# EAGLE design ptn_2013 (EAGLE 5.10)
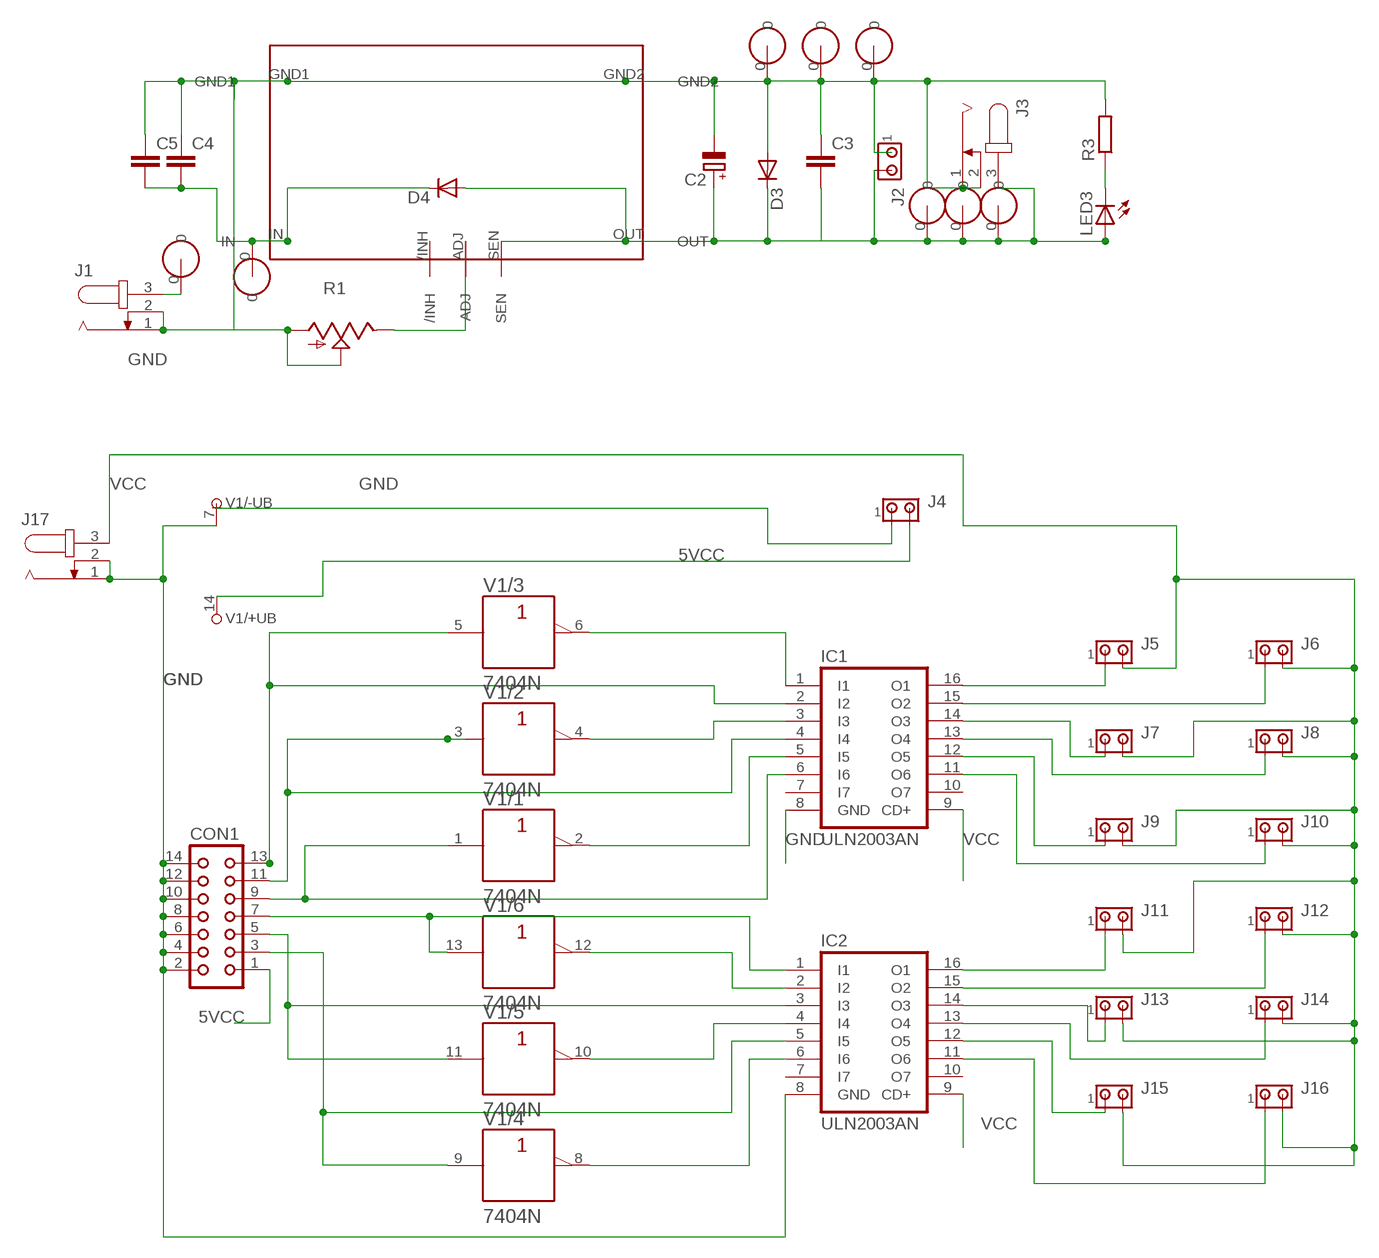
[diagram p0: schematic, sheet 1]

## Parts
C2  CPOL-EUE3.5-8  [E3,5-8]
C3  C-EUC1206K  [C1206K]
C4  C-EUC1206K  [C1206K]
C5  C-EUC1206K  [C1206K]
CON1  CON14  [CON14]
D3  DIODE-SMB  [SMB]
D4  DIODE-SMB  [SMB]
IC1  ULN2003AN  [DIL16]
IC2  ULN2003AN  [DIL16]
J1  JACK-PLUG1  [SPC4078]
J2  MTA02-100  [10X02MTA]
J3  JACK-PLUG1  [SPC4078]
J4  MTA02-100  [10X02MTA]
J5  MTA02-100  [10X02MTA]
J6  MTA02-100  [10X02MTA]
J7  MTA02-100  [10X02MTA]
J8  MTA02-100  [10X02MTA]
J9  MTA02-100  [10X02MTA]
J10  MTA02-100  [10X02MTA]
J11  MTA02-100  [10X02MTA]
J12  MTA02-100  [10X02MTA]
J13  MTA02-100  [10X02MTA]
J14  MTA02-100  [10X02MTA]
J15  MTA02-100  [10X02MTA]
J16  MTA02-100  [10X02MTA]
J17  JACK-PLUG1  [SPC4078]
LED3  LED3MM  [LED3MM]
R1  TRIM_US-B64Y  [B64Y]
R3  R-EU_R0603  [R0603]
U$1  PTNPTN2  [PTN]
U$2  PAD0  [SWITCHPAD]
U$3  PADSWITCHPAD1  [SWITCHPAD]
U$4  PADSWITCHPAD1  [SWITCHPAD]
U$5  PADSWITCHPAD1  [SWITCHPAD]
U$6  PADSWITCHPAD1  [SWITCHPAD]
U$7  PADSWITCHPAD1  [SWITCHPAD]
U$8  PADSWITCHPAD1  [SWITCHPAD]
U$9  PADSWITCHPAD1  [SWITCHPAD]
V1  7404N  [DIL14]

## Nets
5VCC: CON1.1 J4.2 V1.14(/+UB:+UB)
GND: C2.- C3.1 C4.1 C5.1 CON1.2 CON1.4 CON1.6 CON1.8 CON1.10 CON1.12 CON1.14 D3.A IC1.8(GND) IC2.8(GND) J1.1 J1.2 J2.1 J3.1 J3.2 J4.1 J17.1 J17.2 R1.A R1.S R3.2 U$1.GND1 U$1.GND2 U$4.0 U$6.0 U$8.0 V1.7(/-UB:-UB)
N$2: C4.2 C5.2 D4.C U$1.IN U$2.0
N$3: CON1.13 IC1.2(I2) V1.5(/3:A)
N$4: LED3.K(C) R3.1
N$5: R1.E U$1.ADJ
N$6: CON1.11 IC1.4(I4) V1.3(/2:A)
N$7: J1.3 U$3.0
N$8: CON1.9 IC1.6(I6) V1.1(/1:A)
N$9: C2.+ C3.2 D3.C D4.A J2.2 J3.3 LED3.A U$1.OUT U$1.SEN U$5.0 U$7.0 U$9.0
N$10: CON1.7 IC2.1(I1) V1.13(/6:A)
N$11: CON1.5 IC2.3(I3) V1.11(/5:A)
N$12: CON1.3 IC2.5(I5) V1.9(/4:A)
N$13: IC1.1(I1) V1.6(/3:Y)
N$14: IC2.2(I2) V1.12(/6:Y)
N$15: IC2.4(I4) V1.10(/5:Y)
N$16: IC2.6(I6) V1.8(/4:Y)
N$17: IC1.16(O1) J5.1
N$18: IC1.15(O2) J6.1
N$19: IC1.14(O3) J7.1
N$20: IC1.13(O4) J8.1
N$21: IC1.12(O5) J9.1
N$22: IC1.11(O6) J10.1
N$23: IC2.16(O1) J11.1
N$24: IC2.15(O2) J12.1
N$25: IC2.14(O3) J13.1
N$26: IC2.13(O4) J14.1
N$27: IC2.12(O5) J15.1
N$28: IC2.11(O6) J16.1
N$29: IC1.3(I3) V1.4(/2:Y)
N$30: IC1.5(I5) V1.2(/1:Y)
VCC: IC1.9(CD+) IC2.9(CD+) J5.2 J6.2 J7.2 J8.2 J9.2 J10.2 J11.2 J12.2 J13.2 J14.2 J15.2 J16.2 J17.3
Unconnected: IC1.7(I7) IC1.10(O7) IC2.7(I7) IC2.10(O7) U$1./INH

## Library data of the parts
C2 = rcl:CPOL-EU: POLARIZED CAPACITOR, European symbol
C3-C5 = rcl:C-EU: CAPACITOR, European symbol
CON1 = con-harting:CON14: CONNECTOR
D3 D4 = diode:DIODE-: DIODE
IC1 IC2 = uln-udn:ULN2003A: DRIVER ARRAY
J1 J3 J17 = con-jack:JACK-PLUG: DC POWER JACK Power Jack, DC, Right Angle, Through Hole, Rated 5A at 16VDC, PC Terminals Distributor: Farnell (www.Farnell.de) Drawing: 84N1161.pdf / 84N1162.pdf Manufacturer: SPC Technology (www.spctechnology.com) Type: SPC4077 / SPC 4078
J2 J4-J16 = con-amp:MTA02-100: AMP connector
LED3 = led:LED: LED OSRAM: - CHIPLED LG R971, LG N971, LY N971, LG Q971, LY Q971, LO R971, LY R971 LH N974, LH R974 LS Q976, LO Q976, LY Q976 LO Q996 - Hyper CHIPLED LW Q18S LB Q993, LB Q99A, LB R99A - SideLED LS A670, LO A670, LY A670, LG A670, LP A670 LB A673, LV A673, LT A673, LW A673 LH A674 LY A675 LS A676, LA A676, LO A676, LY A676, LW A676 LS A679, LY A679, LG A679 - Hyper Micro SIDELED® LS Y876, LA Y876, LO Y876, LY Y876 LT Y87S - SmartLED LW L88C, LW L88S LB L89C, LB L89S, LG L890 LS L89K, LO L89K, LY L89K LS L896, LA L896, LO L896, LY L896 - TOPLED LS T670, LO T670, LY T670, LG T670, LP T670 LSG T670, LSP T670, LSY T670, LOP T670, LYG T670 LG T671, LOG T671, LSG T671 LB T673, LV T673, LT T673, LW T673 LH T674 LS T676, LA T676, LO T676, LY T676, LB T676, LH T676, LSB T676, LW T676 LB T67C, LV T67C, LT T67C, LS T67K, LO T67K, LY T67K, LW E67C LS E67B, LA E67B, LO E67B, LY E67B, LB E67C, LV E67C, LT E67C LW T67C LS T679, LY T679, LG T679 LS T770, LO T770, LY T770, LG T770, LP T770 LB T773, LV T773, LT T773, LW T773 LH T774 LS E675, LA E675, LY E675, LS T675 LS T776, LA T776, LO T776, LY T776, LB T776 LHGB T686 LT T68C, LB T68C - Hyper Mini TOPLED® LB M676 - Mini TOPLED Santana® LG M470 LS M47K, LO M47K, LY M47K Source: http://www.osram.convergy.de LUXEON: - LUMILED® LXK2-PW12-R00, LXK2-PW12-S00, LXK2-PW14-U00, LXK2-PW14-V00 LXK2-PM12-R00, LXK2-PM12-S00, LXK2-PM14-U00 LXK2-PE12-Q00, LXK2-PE12-R00, LXK2-PE12-S00, LXK2-PE14-T00, LXK2-PE14-U00 LXK2-PB12-K00, LXK2-PB12-L00, LXK2-PB12-M00, LXK2-PB14-N00, LXK2-PB14-P00, LXK2-PB14-Q00 LXK2-PR12-L00, LXK2-PR12-M00, LXK2-PR14-Q00, LXK2-PR14-R00 LXK2-PD12-Q00, LXK2-PD12-R00, LXK2-PD12-S00 LXK2-PH12-R00, LXK2-PH12-S00 LXK2-PL12-P00, LXK2-PL12-Q00, LXK2-PL12-R00 Source: www.luxeon.com KINGBRIGHT: KA-3528ASYC Source: www.kingbright.com
R1 = pot:TRIM_US-: POTENTIOMETER
R3 = rcl:R-EU_: RESISTOR, European symbol
U$1 = ptn78020_2:PTN
U$2-U$9 = switchpad:PAD
V1 = 74ttl-din:74*04: Hex INVERTER

## Board
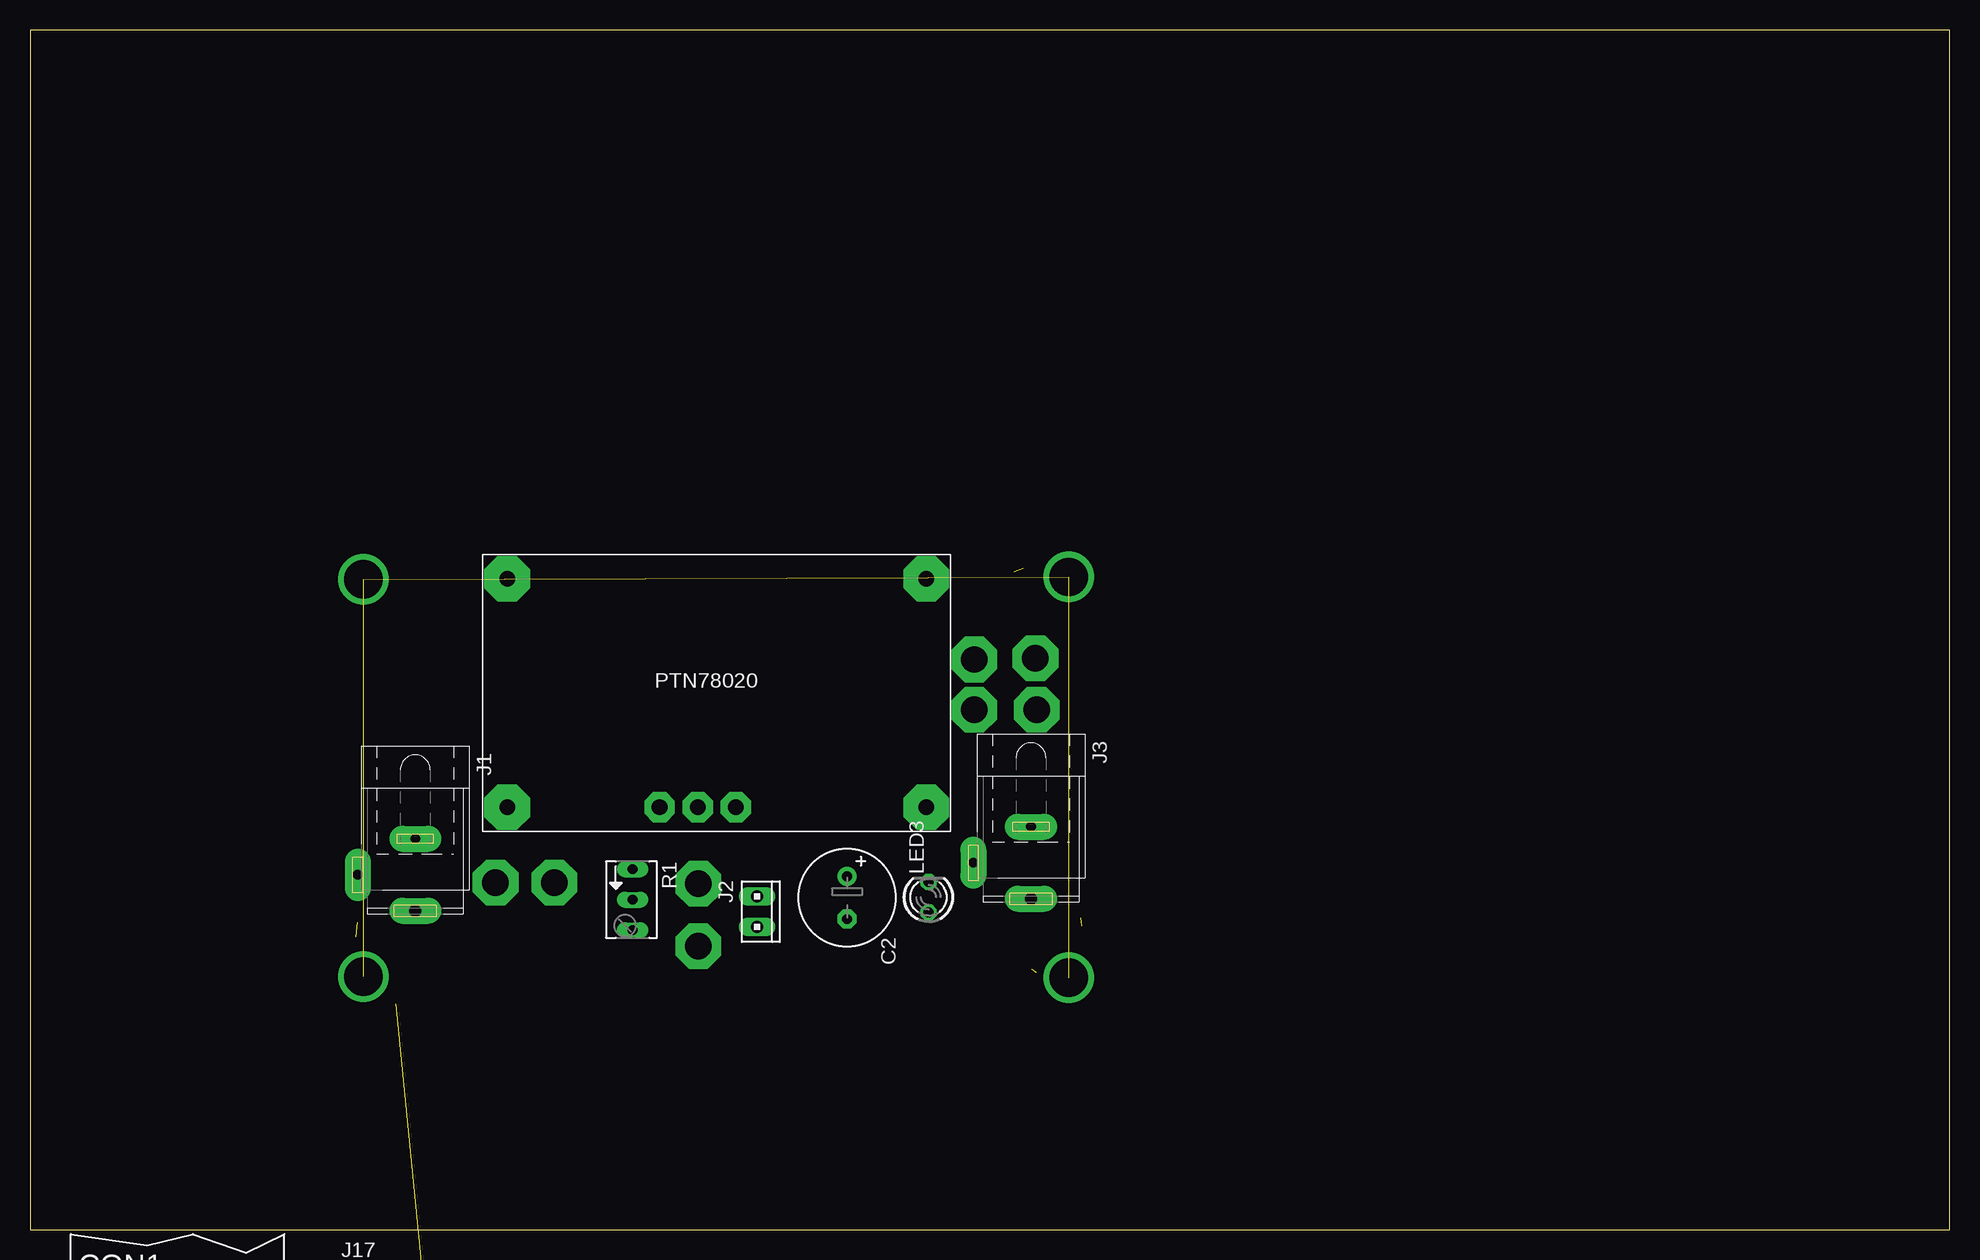
[diagram p1: board, top side]
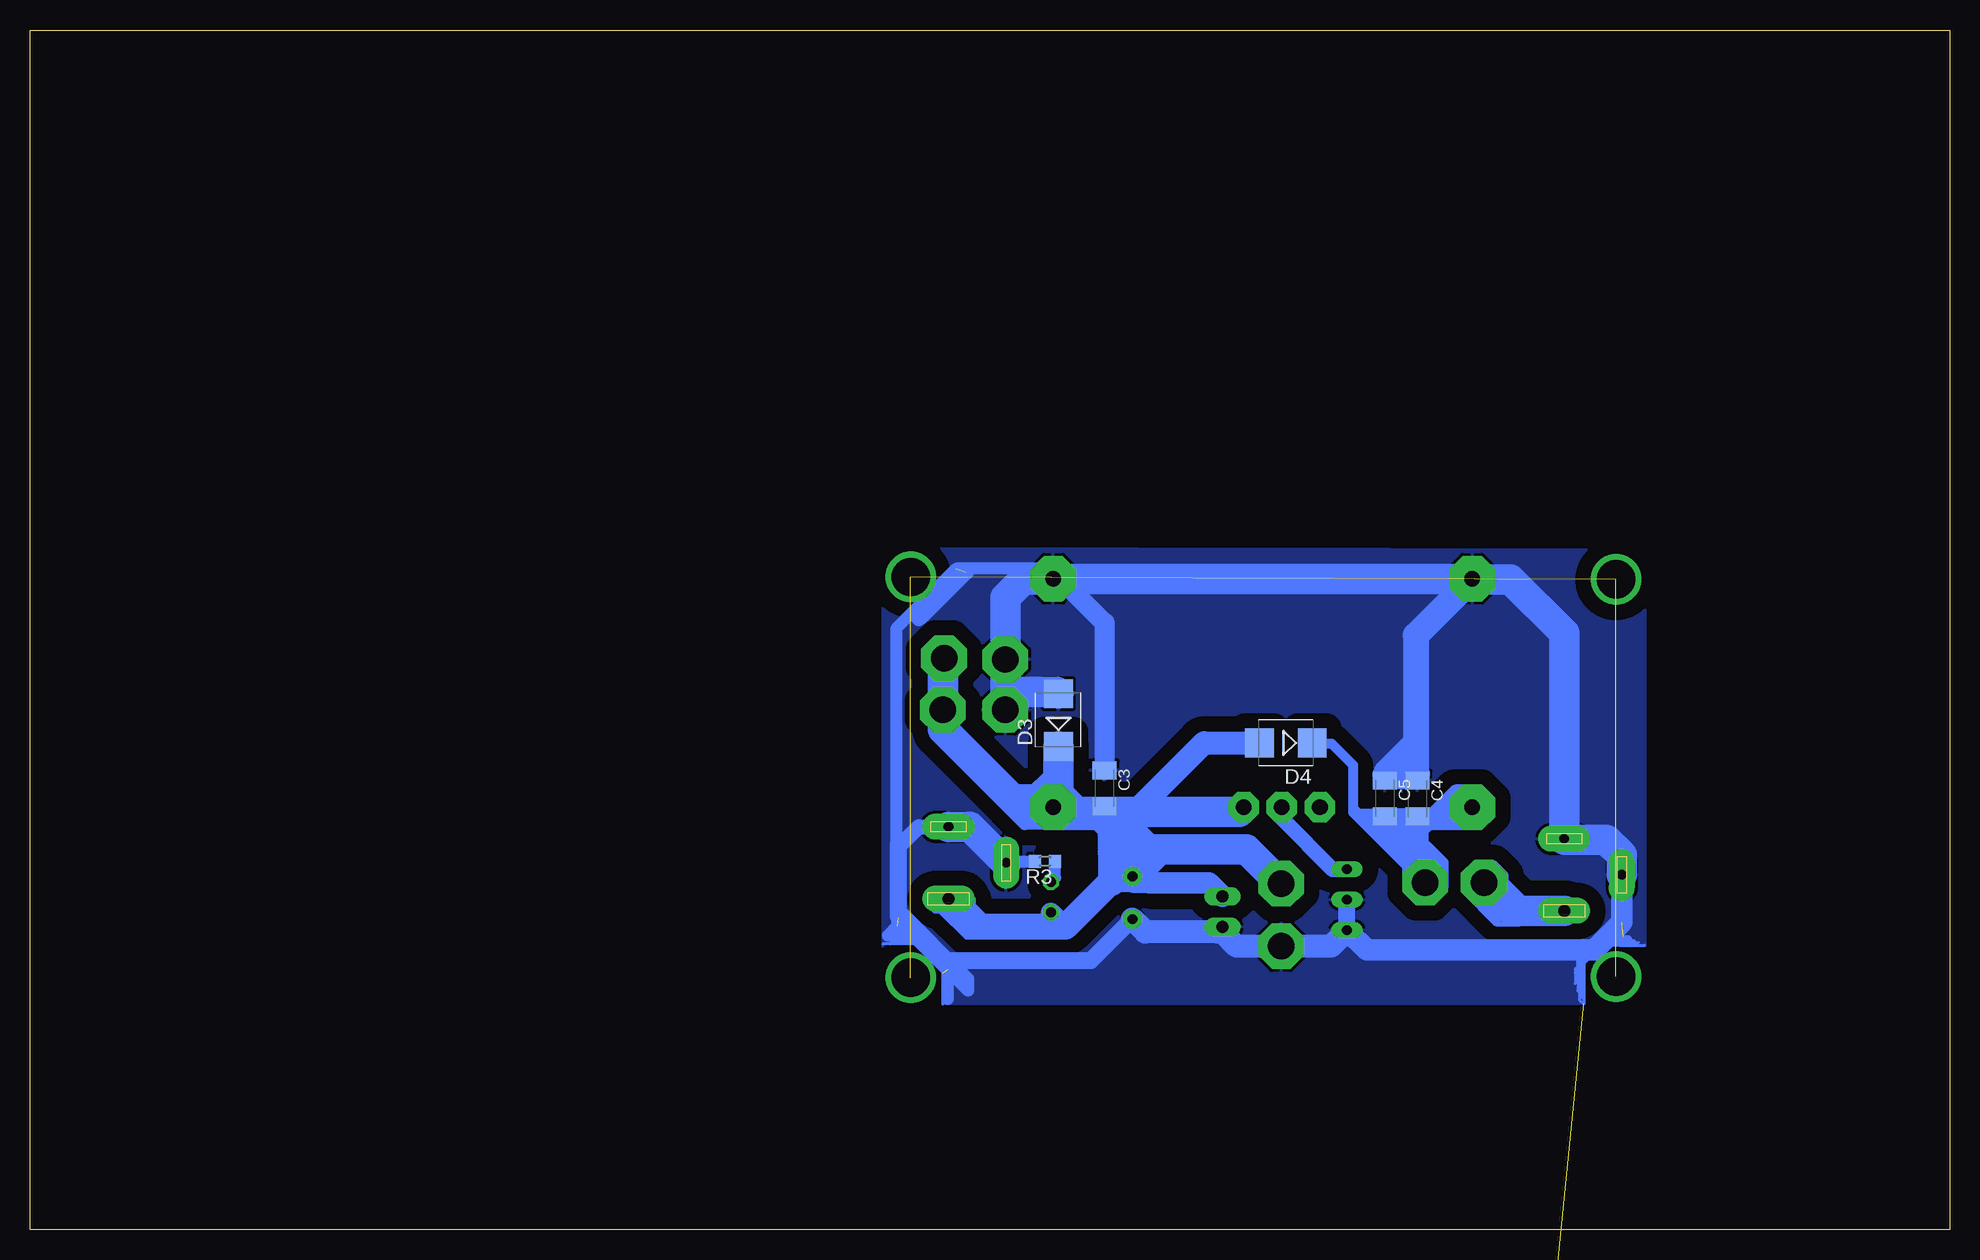
[diagram p2: board, bottom side, seen from below]

Size 160 x 100 mm. Coordinates in mm from the lower left corner, seen from the top.
Outline: 0,0 160,0 160,100 0,100 0,0
Copper layers (1*16): Top 0.035mm / dielectric 1.5mm / Bottom 0.035mm
Design rules "default *": minimum track width 10mil, minimum drill 24mil, track to track 50mil, track to pad 50mil, pad to pad 50mil, via to via 50mil, smd to smd 8mil, copper to edge 40mil, drill to drill 8mil, minimum pad ring 10mil, minimum via ring 8mil, stop-mask expansion 4mil, vias tented up to drill 0mil, thermal gap 10mil

### Footprints (pad centres in the part's own frame; a part is rotated, then mirrored left to right if it is on the bottom)
E3,5-8 = drill 0.813 pad 1.6 round: + -1.778,0 | drill 0.813 pad 1.6 octagon: - 1.778,0
C1206K = smd 1.5 x 2: 1 -1.5,0; 2 1.5,0
CON14 = drill 0.914 round: 1 -7.62,-1.27 | drill 0.914 octagon: 2 -7.62,1.27; 3 -5.08,-1.27; 4 -5.08,1.27; 5 -2.54,-1.27; 6 -2.54,1.27; 7 0,-1.27; 8 0,1.27; 9 2.54,-1.27; 10 2.54,1.27; 11 5.08,-1.27; 12 5.08,1.27; 13 7.62,-1.27; 14 7.62,1.27
SMB = smd 2.4 x 2.4: A 2.2,0; C -2.2,0
DIL16 = drill 0.813 long: 1 -8.89,-3.81; 2 -6.35,-3.81; 3 -3.81,-3.81; 4 -1.27,-3.81; 5 1.27,-3.81; 6 3.81,-3.81; 7 6.35,-3.81; 8 8.89,-3.81; 9 8.89,3.81; 10 6.35,3.81; 11 3.81,3.81; 12 1.27,3.81; 13 -1.27,3.81; 14 -3.81,3.81; 15 -6.35,3.81; 16 -8.89,3.81
SPC4078 = drill 0.8 pad 2.184 long: 1 -3,0; 2 0,-4.8 | drill 1 pad 2.184 long: 3 3,0
10X02MTA = drill 1.016 long: 1 1.27,0; 2 -1.27,0
LED3MM = drill 0.813 octagon: A -1.27,0; K 1.27,0
B64Y = drill 0.813 long: A 2.54,0; E -2.54,0; S 0,0
R0603 = smd 1 x 1.1: 1 -0.85,0; 2 0.85,0
PTN = drill 1.3 pad 2.54 octagon: /INH 14.73,-21.08; ADJ 17.91,-21.08; SEN 21.09,-21.08 | drill 1.3 pad 3.81 octagon: GND1 2.03,-2.03; GND2 36.96,-2.03; IN 2.03,-21.08; OUT 36.96,-21.08
SWITCHPAD = drill 2.2 pad 3.81 octagon: 0 -0.093,-0.175
DIL14 = drill 0.813 long: 1 -7.62,-3.81; 2 -5.08,-3.81; 3 -2.54,-3.81; 4 0,-3.81; 5 2.54,-3.81; 6 5.08,-3.81; 7 7.62,-3.81; 8 7.62,3.81; 9 5.08,3.81; 10 2.54,3.81; 11 0,3.81; 12 -2.54,3.81; 13 -5.08,3.81; 14 -7.62,3.81

### Placement (x,y rotation side)
C2  68.11,27.66 270 top
C3  70.43,36.79 270 bottom
C4  44.34,35.93 270 bottom
C5  47.06,35.96 270 bottom
CON1  12.3,-9.9 0 top  (outside the outline)
D3  74.28,42.47 90 bottom
D4  55.33,40.57 180 bottom
IC1  12.3,-21.4 0 top  (outside the outline)
IC2  12.3,-34.5 0 top  (outside the outline)
J1  32.12,29.57 270 top
J2  60.6,26.5 270 top
J3  83.44,30.57 270 top
J4  3.3,-43.5 0 top  (outside the outline)
J5  9.9,-43.5 0 top  (outside the outline)
J6  16.5,-43.6 0 top  (outside the outline)
J7  23.1,-43.6 0 top  (outside the outline)
J8  29.7,-43.5 0 top  (outside the outline)
J9  36.3,-43.5 0 top  (outside the outline)
J10  3.3,-50.2 0 top  (outside the outline)
J11  9.9,-50.2 0 top  (outside the outline)
J12  16.5,-50.2 0 top  (outside the outline)
J13  23.1,-50.2 0 top  (outside the outline)
J14  29.7,-50.2 0 top  (outside the outline)
J15  36.3,-50.2 0 top  (outside the outline)
J16  3.3,-56.8 0 top  (outside the outline)
J17  36.1,-7.4 0 top  (outside the outline)
LED3  74.9,27.7 90 top
R1  50.23,27.49 270 top
R3  75.4,30.7 180 bottom
U$1  37.75,56.28 0 top
U$2  43.8,29.1 0 top
U$3  38.9,29.1 0 top
U$4  55.8,23.8 0 top
U$5  55.8,29 0 top
U$6  78.8,43.5 0 top
U$7  84,43.5 0 top
U$8  78.8,47.7 0 top
U$9  83.9,47.8 0 top
V1  34.5,-34.5 0 top  (outside the outline)

### Tracks (layer width: path | path; a pad name or v marks a point on that pad's centre or on a via)
5VCC  (2 unrouted)
GND  (17 unrouted)
  Bottom 0.254: 83.9,18.8 83.9,21.4 86.3,23.8 88.3,23.8 | 88.3,23.8 88.9,23.8 | 88.3,23.8 88.1,24 86.8,24 86.7,23.9 | 30.8,22.5 30.8,19.1 30.5,18.8 30.5,22.5 30.7,22.7 30.7,19.4 30.6,19.3 30.6,19.5 31,19.9 31,21.6 | 31,21.6 31,22.4 | 31.2,21.4 31,21.6 | 31.2,21.4 31.2,20.5 | 31.2,21.4 31.2,21.7 31.1,21.8 30.8,21.8 28.4,24.2 28.4,23.9 28.2,23.7 27.5,23.7 | 27.5,23.7 25.4,23.7 | 27.5,23.7 27.7,23.9 26.1,23.9 | 26.1,23.9 25.9,23.9 | 26.1,23.9 26.3,24.1 27.5,24.1 27.2,24.4 26.7,24.4 26.6,24.3 27.2,24.3 27.3,24.2
  Bottom 1.016: R3.2 78.1,30.7 78.23,30.57 J3.2 | 87.6,32.3 87.6,32.4 87.8,32.6 87.8,50.1 82.8,55.1 75.7,55.1 74.8,54.2 74.7,54.1 | 87.6,25 86.9,25 81.8,19.9 81.8,20.9 87.7,26.8 87.7,25.3 88.5,24.5 86.2,24.5 86.1,24.4 86.1,24.3 83.5,21.7 83.5,19.2
  Bottom 1.27: J3.1 85.93,33.57 87.6,31.9 | 81.9,54.8 82,54.8 85.9,50.9
  Bottom 1.422: C4.1 44.37,37.46 C5.1 44.54,37.46 44,38 44.5,38 | 44.5,38 47.1,38 47.3,38 47.4,37.9 44.6,37.9 44.5,38 | R1.A R1.S | 60.5,24.7 60.5,25.13 J2.1 60.6,25.2 61,24.8 | C2.- 71.59,22.4 84,22.4 87.6,26 87.6,31.9 87.6,32.3
  Bottom 1.676: C3.1 70.42,50.57 74.1,54.25
  Bottom 1.778: R1.A 48.57,23.3 29.6,23.3 27.32,25.58 J1.2
  Bottom 1.93: 47.1,38 47.1,38.1 44.8,40.4 | R1.A 51.56,23.62 U$4.0 59.42,23.62 60.5,24.7 | 61,24.8 67.02,24.8 C2.-
  Bottom 2.184: 44.5,38 44.5,49.53 U$1.GND1
  Bottom 2.54: J1.2 27.32,31.22 28.6,32.5 32.05,32.5 J1.1 32.12,49.72 36.6,54.2 39.73,54.2 U$1.GND1 74.1,54.25 U$1.GND2 74.76,54.2 74.8,54.2 77.2,54.2 78.71,52.69 U$8.0 U$6.0 77.23,44.8 74.41,44.8 D3.A | J3.2 81.64,33.57 J3.1
  pour Bottom: 25.4,18.8 88.9,18.8 88.9,56.8 25.4,56.7
N$1  (via drill 3.2)  (3 unrouted)
  other vias: 27.8,54.2 27.8,21.1 86.6,21 86.6,54.4
N$2
  Bottom 0.254: 47.9,33 49.5,34.6 49.3,34.6 | 49.3,34.6 48.3,33.6 48.3,33.8 48.5,34 48.3,34 | 49.2,34.6 49.3,34.6
  Bottom 0.406: 43.5,33.7 43.3,33.9 | 44.2,33 43.6,33.6 | 44.2,33 44.2,32.7 | 44.2,33 44.2,33.4 43.8,33 43.8,32.5 | 42.1,28.5 42,28.5 42,30.7 43.5,32.2 | 43.8,32.5 45,33.7 45,33.3 42.2,30.5 42.2,28.7 42.3,28.6 42.3,30.2 42.6,30.5 44.2,30.5 45.4,29.3 45.4,30.6 45.6,30.8 45.6,30.4 | 45.6,30.4 45.1,29.9 | 45.6,30.4 49.9,34.7 49.9,35.2 49.7,35.2 49.4,34.9 47.2,34.9 47,34.7 44.7,34.7 43.8,33.8 43.7,33.7 | 43.8,32.5 43.5,32.2 | 43.5,32.2 43.5,32 43.6,32.1 43.6,33.2 | 43.6,33.2 43.6,33.6 | 43.6,33.6 43.5,33.7 | 43.5,33.7 43.1,33.7 43.6,33.2
  Bottom 0.813: C5.2 49.06,34.46 49.2,34.6 49.7,35.1 49.7,35.2 49.7,35.3 49.7,38.7 51.5,40.5 53.06,40.5 D4.C
  Bottom 1.016: 43.2,34.6 41.2,36.6 39.4,36.6 40.2,35.8 41.1,35.8 41.7,35.2 41.8,35.2 40.4,33.8 | 40.4,33.8 39.5,33.8 | 43.8,33.8 40.4,33.8
  Bottom 1.422: 46.7,33.9 46.7,34.1 C5.2 44.37,34.46 C4.2 41.73,34.43 41.7,34.4 45.3,34.4 45.6,34.1 41.8,34.1 40.7,35.2 | 40.7,35.2 40.7,34.8 41.4,34.1 40.88,34.1 U$1.IN | 39.9,35.3 40.6,35.3 40.7,35.2
  Bottom 2.184: 47,33.7 46.9,33.7 46.7,33.9
  Bottom 2.54: 47,33.7 43.71,30.41 U$2.0
N$3  (2 unrouted)
N$4
  Bottom 1.016: LED3.K 74.55,29.32 R3.1
N$5
  Bottom 1.27: U$1.ADJ 55.66,34.26 51.4,30 50.26,30 R1.E
N$6  (2 unrouted)
N$7
  Bottom 0.406: 35.8,25.5 37.8,25.5 40.5,28.2 40.5,28.5 37.8,25.8 37.6,25.8 38.9,27.1 38.9,27.3 39.3,27.7 | 39.3,27.7 39.9,28.3 | 39.3,27.7 35.8,27.7 37,28.9 37,29.6 38,30.6 38.3,30.6 37.2,29.5 37.2,29.2 38.1,30.1 38.3,30.1 38.4,30.2 38.4,30.5 35.3,27.4 35.3,26.6
  Bottom 1.016: 35.3,26.6 35.7,26.6 35.7,26.57
  Bottom 2.54: U$3.0 36.45,26.57 35.7,26.57 J1.3
N$8  (2 unrouted)
N$9
  Bottom 0.254: 71.5,34.7 71.7,34.7 71.7,34.8
  Bottom 0.305: 80.8,24.3 82,24.3 84.2,26.5 84.6,26.5 85,26.9 85,27.2 84.6,26.8 84.2,26.8 82,24.6 82,24.5 84.8,27.3 84.9,27.3 84.5,27.7 84.5,27.3 83.6,28.2 83.44,28.2 | 83.44,28.2 81.9,28.2 81.3,27.6 81.3,27.1 | 81.3,27.1 80.2,26 | 81.3,27.1 82,27.8 82,27.9 82.1,28 82.2,28 81.8,27.6 81.5,27.6 81.7,27.8 81.8,27.8 | 83.44,28.2 J3.3
  Bottom 0.61: 69.9,34.8 70.13,35.03 C3.2
  Bottom 1.016: 74.6,33.9 74.5,34 | 74.6,33.9 74.7,33.8 77.1,33.8 78.6,35.3 77.3,36.6 | 77.3,36.6 77.9,36.6 | 77.3,36.6 73.5,36.6 72,35.1 71.1,35.1 71.5,34.7 71.5,33.9 74.6,33.9 | 74.6,33.9 74.5,33.8 71.3,33.8 75,37.5 75,37.9 76.6,36.3 76.6,36.1
  Bottom 1.27: 68.11,28.91 68.11,29.39 68.1,29.4
  Bottom 1.676: 66.7,28.9 68.1,28.9 68.11,28.91 C2.+ | 73.7,25.23 LED3.A
  Bottom 1.778: 66.7,28.9 61.73,28.9 J2.2
  Bottom 1.93: D4.A 62.13,40.57 68.9,33.8
  Bottom 2.184: C2.+ 68.11,30.11 69.9,31.9 | 69.9,31.9 69.9,31.4 | 69.9,31.4 69.9,29 69.8,28.9 69.8,31.3 69.9,31.4 | 69.9,31.9 69.9,33.4 71.3,34.8 | 69.2,29.4 69.53,29.4 73.7,25.23 81.09,25.23 J3.3
  Bottom 2.54: U$1.OUT 74.31,34.8 71.7,34.8 71.3,34.8 70.3,34.8 | 70.3,34.8 69.9,34.8 59.24,34.8 U$1.SEN | 70.3,34.8 68.11,32.61 | U$5.0 55.73,28.82 58.6,31.7 65.85,31.7 | 65.85,31.7 C2.+ | 65.85,31.7 66.8,31.7 68.9,33.8 | 68.1,29.4 69.2,29.4 | U$1.OUT 74.28,35.62 D3.C | U$1.OUT 77.4,35.2 83.91,41.71 U$7.0 83.91,47.62 U$9.0
N$10  (2 unrouted)
N$11  (2 unrouted)
N$12  (2 unrouted)
N$13  (1 unrouted)
N$14  (1 unrouted)
N$15  (1 unrouted)
N$16  (1 unrouted)
N$17  (1 unrouted)
N$18  (1 unrouted)
N$19  (1 unrouted)
N$20  (1 unrouted)
N$21  (1 unrouted)
N$22  (1 unrouted)
N$23  (1 unrouted)
N$24  (1 unrouted)
N$25  (1 unrouted)
N$26  (1 unrouted)
N$27  (1 unrouted)
N$28  (1 unrouted)
N$29  (1 unrouted)
N$30  (1 unrouted)
VCC  (14 unrouted)